# EasyEDA Pro project CH32V203C8T6采样模块.eprj, board 电源采样PCB
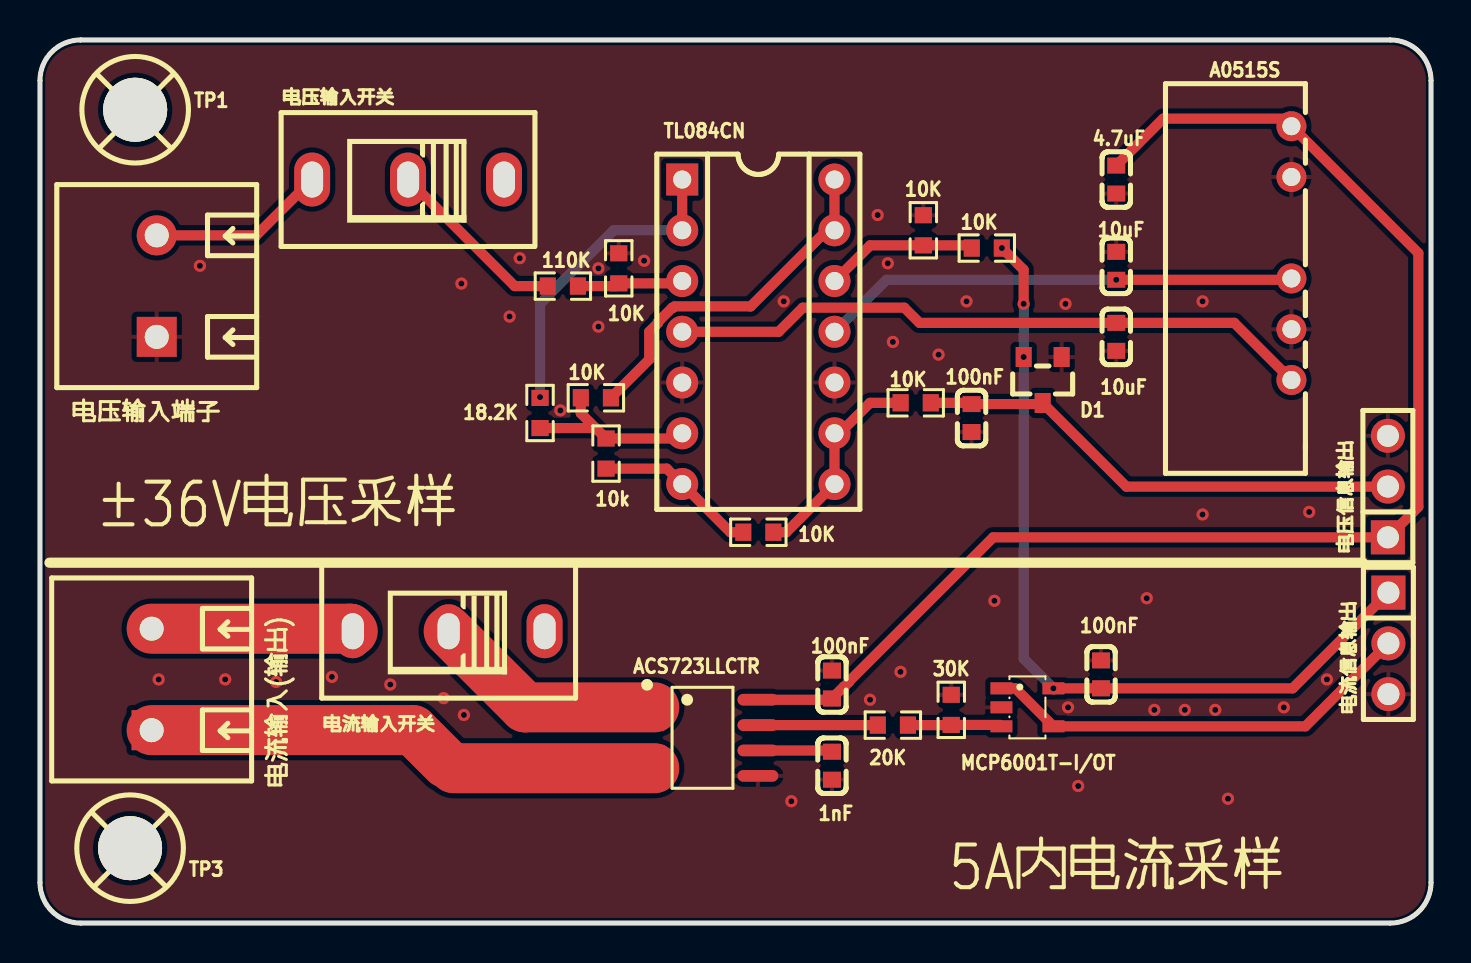
[diagram p9: board, top side]
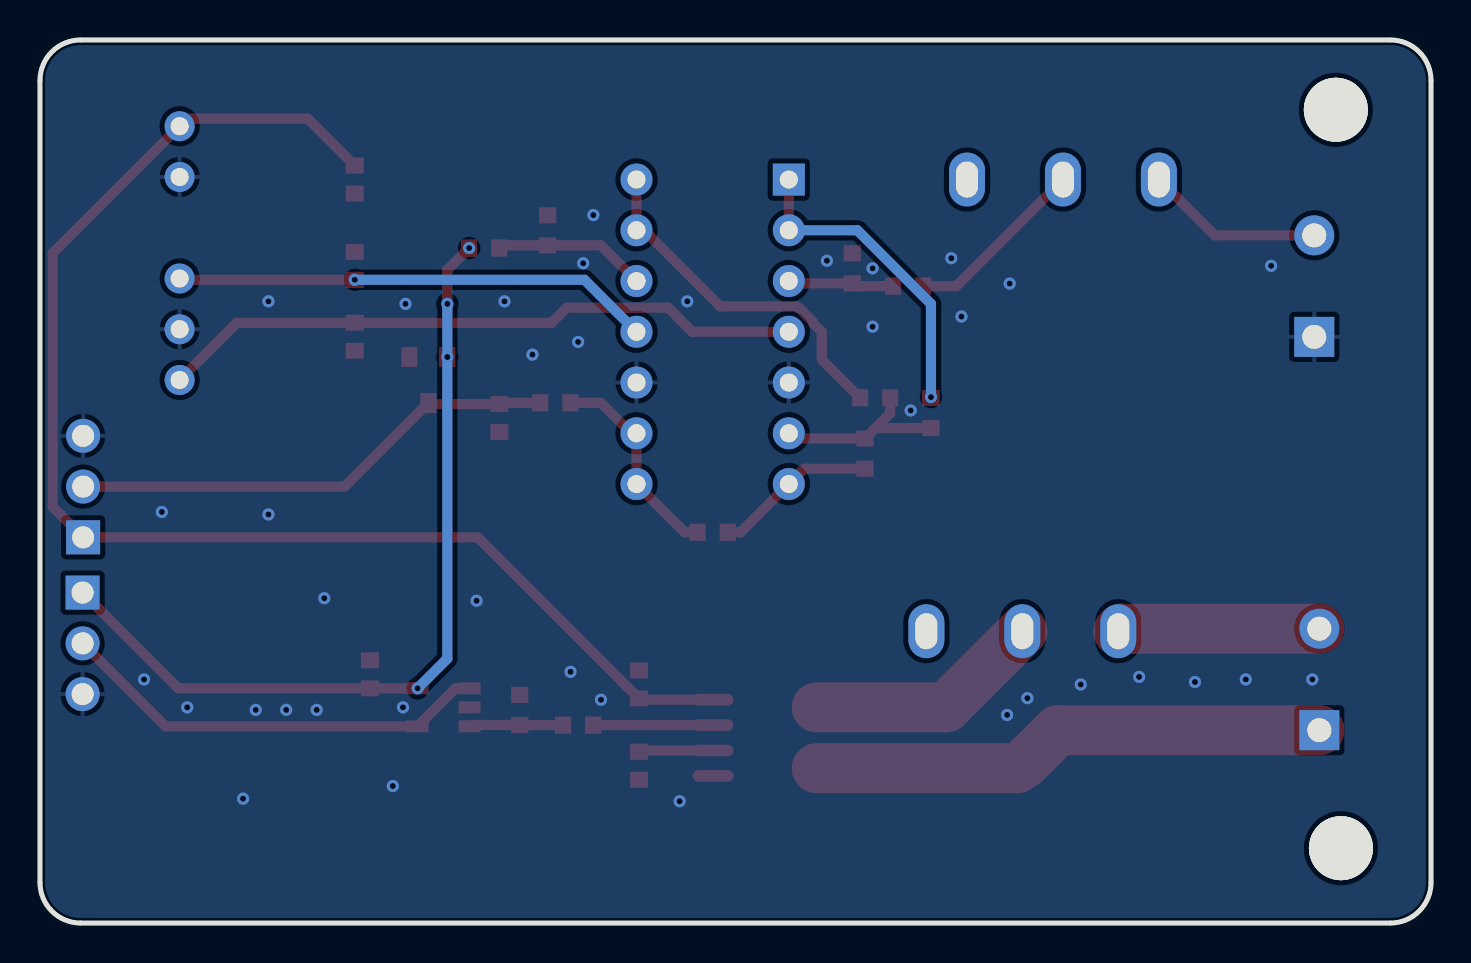
[diagram p10: board, bottom side, seen from below]

Outline 69.6 x 44.2 mm; copper layers: Top Layer, Bottom Layer. Coordinates in mm from the lower left corner of the outline.
Outline path: 0,42.16 0,2.03 arc(0.6,0.6) 2.03,0 67.56,0 arc(69,0.6) 69.6,2.03 69.6,42.16 arc(69,43.6) 67.56,44.2 2.03,44.2 arc(0.6,43.6) 0,42.16
Stack: Top Layer 0.035mm / Dielectric1 1.51mm FR4 er 4.5 / Bottom Layer 0.035mm

## Design rules (mm)
template: JLCPCB Capability(Two Layers Board)
spacing copperThickness1oz (default): track to track 0.102, other pairs 0.152 to 0.3
spacing copperThickness2oz: track to track 0.203, other pairs 0.152 to 0.3
track width copperThickness1oz (default): min 0.127, default 0.254, max 2.54
track width copperThickness2oz: min 0.203, default 0.254, max 2.54
differential pair differentialPair (default): width min 0.127, default 0.254, max 2.54; gap min 0.152, default 0.152
via viaSize (default): diameter min 0.5, default 0.61, max 10; hole min 0.3, default 0.305, max 6.3

## Placement (name value [footprint] x y rotation side)
1nF  1nF  [C0603]  39.62 7.87 90 top
4.7uF  4.7uF  [C0603]  53.85 37.21 90 top
10K  -  [R0603]  44.2 34.67 270 top
10k  10kΩ  [R0603]  28.32 23.5 90 top
10K#2  -  [R0603]  43.82 26.03 180 top
10K#3  -  [R0603]  35.94 19.56 180 top
10K#4  -  [R0603]  27.81 26.29 0 top
10K#5  -  [R0603]  28.96 32.77 90 top
10K#6  -  [R0603]  47.37 33.78 180 top
10uF  -  [C0603]  53.85 29.34 90 top
10uF#2  -  [C0603]  53.85 32.89 90 top
18.2K  18.2kΩ  [R0603]  25.02 25.53 270 top
20K  20kΩ  [R0603]  42.67 9.91 0 top
30K  30kΩ  [R0603]  45.59 10.67 90 top
100nF  -  [C0603]  39.62 11.94 270 top
100nF#2  -  [C0603]  46.61 25.27 270 top
100nF#3  -  [C0603]  53.09 12.45 270 top
110K  110kΩ  [R0603]  26.16 31.88 0 top
A0515S  100kHz  [PWRM-TH_5P-L19.5-W7.0-P2.54_A0324S-2WR3]  62.61 33.53 270 top
ACS723LLCTR  ACS723LLCTR-05AB-T  [SOIC-8_L4.9-W3.9-P1.27-LS6.0-BL]  33.15 9.27 270 top
D1  BAT54SLT1G  [SOT-23_L2.9-W1.3-P1.90-LS2.4-BR]  50.17 27.18 90 top
MCP6001T-I/OT  MCP6001T-I/OT  [SOT-23-5_L3.0-W1.7-P0.95-LS2.8-BR]  49.4 10.8 180 top
TL084CN  TL084CN  [DIP-14_L17.8-W10.2-P2.54-BL_3]  35.94 29.59 270 top
TP1  -  [M3螺丝]  4.83 40.64 0 top
TP3  -  [M3螺丝]  4.57 3.68 0 top
电压信息输出  PZ254V-11-03P  [HDR-TH_3P-P2.54-V-M]  67.44 21.84 90 top
电压输入开关  SS-12D10G6-G  [SW-TH_SS-12D10G4-G]  18.42 37.21 180 top
电压输入端子  TY500-5.08-02P-14-03  [CONN-TH_TY500-5.08-02P-14-03]  5.84 31.88 90 top
电流信息输出  PZ254V-11-03P  [HDR-TH_3P-P2.54-V-M]  67.46 14 270 top
电流输入(输出)  TY500-5.08-02P-14-03  [CONN-TH_TY500-5.08-02P-14-03]  5.59 12.19 90 top
电流输入开关  SS-12D10G6-G  [SW-TH_SS-12D10G4-G]  20.45 14.61 180 top

## Footprints (pads in the part's own frame, mm; a bottom-side part is the same pattern mirrored in y, then rotated)
C0603
  rect 0.8x0.9 smd: 1(-0.7,0) 2(0.7,0)
CONN-TH_TY500-5.08-02P-14-03
  rect 2x2 hole 1.2: 1(-2.54,0)
  round 2 hole 1.2: 2(2.54,0)
DIP-14_L17.8-W10.2-P2.54-BL_3
  rect 1.6x1.6 hole 0.9: 1(-7.62,-3.81)
  round 1.6 hole 0.9: 2(-5.08,-3.81) 3(-2.54,-3.81) 4(0,-3.81) 5(2.54,-3.81) 6(5.08,-3.81) 7(7.62,-3.81) 8(7.62,3.81) 9(5.08,3.81) 10(2.54,3.81) 11(0,3.81) 12(-2.54,3.81) 13(-5.08,3.81) 14(-7.62,3.81)
HDR-TH_3P-P2.54-V-M
  rect 1.7x1.7 hole 1.1: 1(-2.54,0)
  round 1.7 hole 1.1: 2(0,0) 3(2.54,0)
M3螺丝
  round 3.2 hole 3.2: 1(-0.064,0.064)
PWRM-TH_5P-L19.5-W7.0-P2.54_A0324S-2WR3
  round 1.5 hole 0.9: 1(-6.35,0) 2(-3.81,0) 4(1.27,0) 5(3.81,0) 6(6.35,0)
R0603
  rect 0.806x0.864 smd: 1(-0.753,0) 2(0.753,0)
SOIC-8_L4.9-W3.9-P1.27-LS6.0-BL
  oval 0.588x2.045 smd: 1(-1.905,-2.772) 2(-0.635,-2.772) 3(0.635,-2.772) 4(1.905,-2.772) 5(1.905,2.772) 6(0.635,2.772) 7(-0.635,2.772) 8(-1.905,2.772)
SOT-23-5_L3.0-W1.7-P0.95-LS2.8-BR
  rect 1.1x0.6 smd: 1(1.3,-0.95) 2(1.3,0) 3(1.3,0.95) 4(-1.3,0.95) 5(-1.3,-0.95)
SOT-23_L2.9-W1.3-P1.90-LS2.4-BR
  rect 1x0.8 smd: 1(1.15,-0.95) 2(1.15,0.95) 3(-1.15,0)
SW-TH_SS-12D10G4-G
  oval 1.8x2.7 hole 1.1x1.8: 1(-4.8,0) 2(-0.001,0) 3(4.8,0)

## Nets
3V3: 10K#6.1 100nF#3.2 D1.2 MCP6001T-I/OT.5 电流信息输出.1
+1.65V: 10K#4.2 TL084CN.13 TL084CN.14
+5V: 4.7uF.2 100nF.2 A0515S.1 ACS723LLCTR.8 电压信息输出.1
+15V: 10uF.2 A0515S.6 TL084CN.4
-15V: 10uF#2.1 A0515S.4 TL084CN.11
GND: 1nF.1 4.7uF.1 10K.1 10K#5.2 10uF.1 10uF#2.2 30K.2 100nF.1 100nF#2.2 100nF#3.1 A0515S.2 A0515S.5 ACS723LLCTR.5 D1.1 MCP6001T-I/OT.2 TL084CN.5 TL084CN.10 电压信息输出.3 电压输入端子.1 电流信息输出.3
+: 电流输入(输出).2 电流输入开关.3
-: ACS723LLCTR.3 ACS723LLCTR.4 电流输入(输出).1
AOUT: MCP6001T-I/OT.1 MCP6001T-I/OT.4 电流信息输出.2
VOUT: 10K#2.1 100nF#2.1 D1.3 电压信息输出.2
$1N1532: 18.2K.1 TL084CN.1 TL084CN.2
$1N1535: 10k.1 10K#3.2 TL084CN.7
$1N1537: 10K#5.1 110K.2 TL084CN.3
$1N1538: 10k.2 10K#4.1 18.2K.2 TL084CN.6
$1N1648: 电压输入开关.3 电压输入端子.2
$1N1663: 110K.1 电压输入开关.2
$1N1738: ACS723LLCTR.1 ACS723LLCTR.2 电流输入开关.2
$1N4970: 10K#2.2 10K#3.1 TL084CN.8 TL084CN.9
$1N5316: 10K.2 10K#6.2 TL084CN.12
$1N5488: 1nF.2 ACS723LLCTR.6
$1N5650: 20K.1 ACS723LLCTR.7
$1N5654: 20K.2 30K.1 MCP6001T-I/OT.3

Pads without a net: TP1 1; TP3 1; 电压输入开关 1; 电流输入开关 1

## Via types
v1: diameter 0.61, hole 0.305, Top Layer to Bottom Layer, 44 vias

## Routing (per net, layer and track width the routed paths; a pad name or vN(x,y) marks a point on that pad's centre or on a via; arc(x,y) is an arc through that point)
3V3: length 41.8
  Top Layer w0.508: 100nF#3.2 62.67,11.75 电流信息输出.1 ; v1(50.7,11.75) 53.08,11.75 ; v1(48.12,33.78) 49.21,32.69 v1(49.21,30.99)
  Bottom Layer w0.508: v1(49.21,30.99) v1(49.21,28.33) 49.21,13.23 v1(50.7,11.75)
+1.65V: length 18
  Top Layer w0.508: TL084CN.14 TL084CN.13 39.37,34.67 35.56,30.86 31.75,30.86 31.69,30.8 31.63,30.8 30.92,30.09 30.92,30.04 30.48,29.59 30.48,28.2 10K#4.2
+5V: length 68.7
  Top Layer w0.508: 4.7uF.2 56.2,40.26 62.36,40.26 62.61,40 A0515S.1 68.96,33.53 68.96,20.83 电压信息输出.1 47.69,19.3 40.48,12.09 40.48,12.07 40.24,11.83 40.22,11.83 100nF.2 39.56,11.18 ACS723LLCTR.8
+15V: length 32.5
  Top Layer w0.508: A0515S.6 59.75,30.04 10uF.2 44,30.04 43.24,30.8 38.16,30.8 36.96,29.59 32.13,29.59
-15V: length 24
  Top Layer w0.508: v1(53.85,32.19) 62.55,32.19 A0515S.4
  Bottom Layer w0.508: v1(53.85,32.19) 42.35,32.19 TL084CN.11
GND:
  vias: v1(5.94,12.19) v1(8,32.89) v1(9.27,12.19) v1(11.81,12.06) v1(14.61,12.32) v1(17.53,11.94) v1(20.2,11.25) v1(21.08,32) v1(21.21,10.41) v1(23.49,30.35) v1(24,33.27) v1(26.04,25.65) v1(27.94,32.77) v1(27.94,29.84) v1(30.23,33.15) v1(37.21,31.11) v1(37.59,6.1) v1(41.53,11.18) v1(41.91,35.43) v1(42.42,33.02) v1(42.67,29.08) v1(43.05,12.57) v1(44.96,28.45) v1(46.36,31.11) v1(47.75,16.13) v1(51.31,30.99) v1(51.43,10.8) v1(51.94,6.86) v1(55.37,16.26) v1(55.75,10.67) v1(57.28,10.67) v1(58.17,31.11) v1(58.17,20.45) v1(58.8,10.67) v1(59.44,6.22) v1(62.23,10.8) v1(63.5,20.57) v1(64.39,12.19)
+: length 10.1
  Top Layer w2.5: 电流输入(输出).2 15.52,14.73 15.65,14.61
-: length 25.4
  Top Layer w2.5: 电流输入(输出).1 18.67,9.65 20.32,8 ; 20.7,7.75 30.73,7.75
AOUT: length 21.9
  Top Layer w0.508: 电流信息输出.2 63.31,9.84 MCP6001T-I/OT.4 48.8,11.75 MCP6001T-I/OT.1
VOUT: length 24.7
  Top Layer w0.508: 10K#2.1 46.55,26.03 100nF#2.1 50.11,25.97 D1.3 54.35,21.84 电压信息输出.2
$1N1532: length 15.8
  Top Layer w0.508: 32.13,37.21 32.13,34.67
  Bottom Layer w0.508: v1(25.02,26.32) 25.02,30.99 28.7,34.67 32.13,34.67
$1N1535: length 8.2
  Top Layer w0.508: 10k.1 31.36,22.74 34.54,19.56 10K#3.2
$1N1537: length 5.3
  Top Layer w0.508: 110K.2 28.82,31.88 10K#5.1 32.01,32.01 32.13,32.13
$1N1538: length 9.3
  Top Layer w0.508: 32.13,24.51 31.87,24.25 10k.2 27.8,24.77 ; 10K#4.1 27.06,25.51 27.8,24.77 ; 27.8,24.77 18.2K.2
$1N1648: length 8.9
  Top Layer w0.508: 电压输入开关.3 10.82,34.42 电压输入端子.2
$1N1663: length 9.2
  Top Layer w0.508: 110K.1 23.75,31.88 电压输入开关.2
$1N1738: length 11.9
  Top Layer w2.5: 30.73,10.8 24.26,10.8 电流输入开关.2
$1N4970: length 10.5
  Top Layer w0.508: 10K#3.1 37.34,19.56 TL084CN.8 TL084CN.9 40.01,24.51 41.53,26.03 10K#2.2
$1N5316: length 7.7
  Top Layer w0.508: TL084CN.12 41.54,33.92 10K.2 46.48,33.92 10K#6.2
$1N5488: length 3.7
  Top Layer w0.508: 1nF.2 39.56,8.64 ACS723LLCTR.6
$1N5650: length 6
  Top Layer w0.508: ACS723LLCTR.7 20K.1
$1N5654: length 4.7
  Top Layer w0.508: 20K.2 45.58,9.91 30K.1 48.03,9.91 MCP6001T-I/OT.3

## Copper pours and planes (outline as drawn; the poured copper is in the pictures)
GND on Top Layer: -0.13,42.29 -0.12,42.47 -0.07,42.75 0.01,43.02 0.13,43.28 0.28,43.51 0.47,43.73 0.68,43.91 0.92,44.07 1.18,44.19 1.45,44.27 1.73,44.32 1.91,44.32 67.69,44.32 67.87,44.32 68.15,44.27 68.42,44.19 68.68,44.07 68.91,43.91 69.13,43.73 69.31,43.51 69.47,43.28 69.59,43.02 69.67,42.75 69.72,42.47 69.72,42.29 69.72,1.91 69.72,1.73 69.67,1.45 69.59,1.18 69.47,0.92 69.31,0.68 69.13,0.47 68.91,0.28 68.68,0.13 68.42,0.01 68.15,-0.07 67.87,-0.12 67.69,-0.13 1.91,-0.13 1.73,-0.12 1.45,-0.07 1.18,0.01 0.92,0.13 0.68,0.28 0.47,0.47 0.28,0.68 0.13,0.92 0.01,1.18 -0.07,1.45 -0.12,1.73 -0.13,1.91
GND on Bottom Layer: -0.13,42.29 -0.12,42.47 -0.07,42.75 0.01,43.02 0.13,43.28 0.28,43.51 0.47,43.73 0.68,43.91 0.92,44.07 1.18,44.19 1.45,44.27 1.73,44.32 1.91,44.32 67.69,44.32 67.87,44.32 68.15,44.27 68.42,44.19 68.68,44.07 68.91,43.91 69.13,43.73 69.31,43.51 69.47,43.28 69.59,43.02 69.67,42.75 69.72,42.47 69.72,42.29 69.72,1.91 69.72,1.73 69.67,1.45 69.59,1.18 69.47,0.92 69.31,0.68 69.13,0.47 68.91,0.28 68.68,0.13 68.42,0.01 68.15,-0.07 67.87,-0.12 67.69,-0.13 1.91,-0.13 1.73,-0.12 1.45,-0.07 1.18,0.01 0.92,0.13 0.68,0.28 0.47,0.47 0.28,0.68 0.13,0.92 0.01,1.18 -0.07,1.45 -0.12,1.73 -0.13,1.91

## Text on the board
Top Silkscreen Layer: ±36V电压采样 | 5A内电流采样
